# EAGLE design LooRollSensorTop (EAGLE 7.4.0)
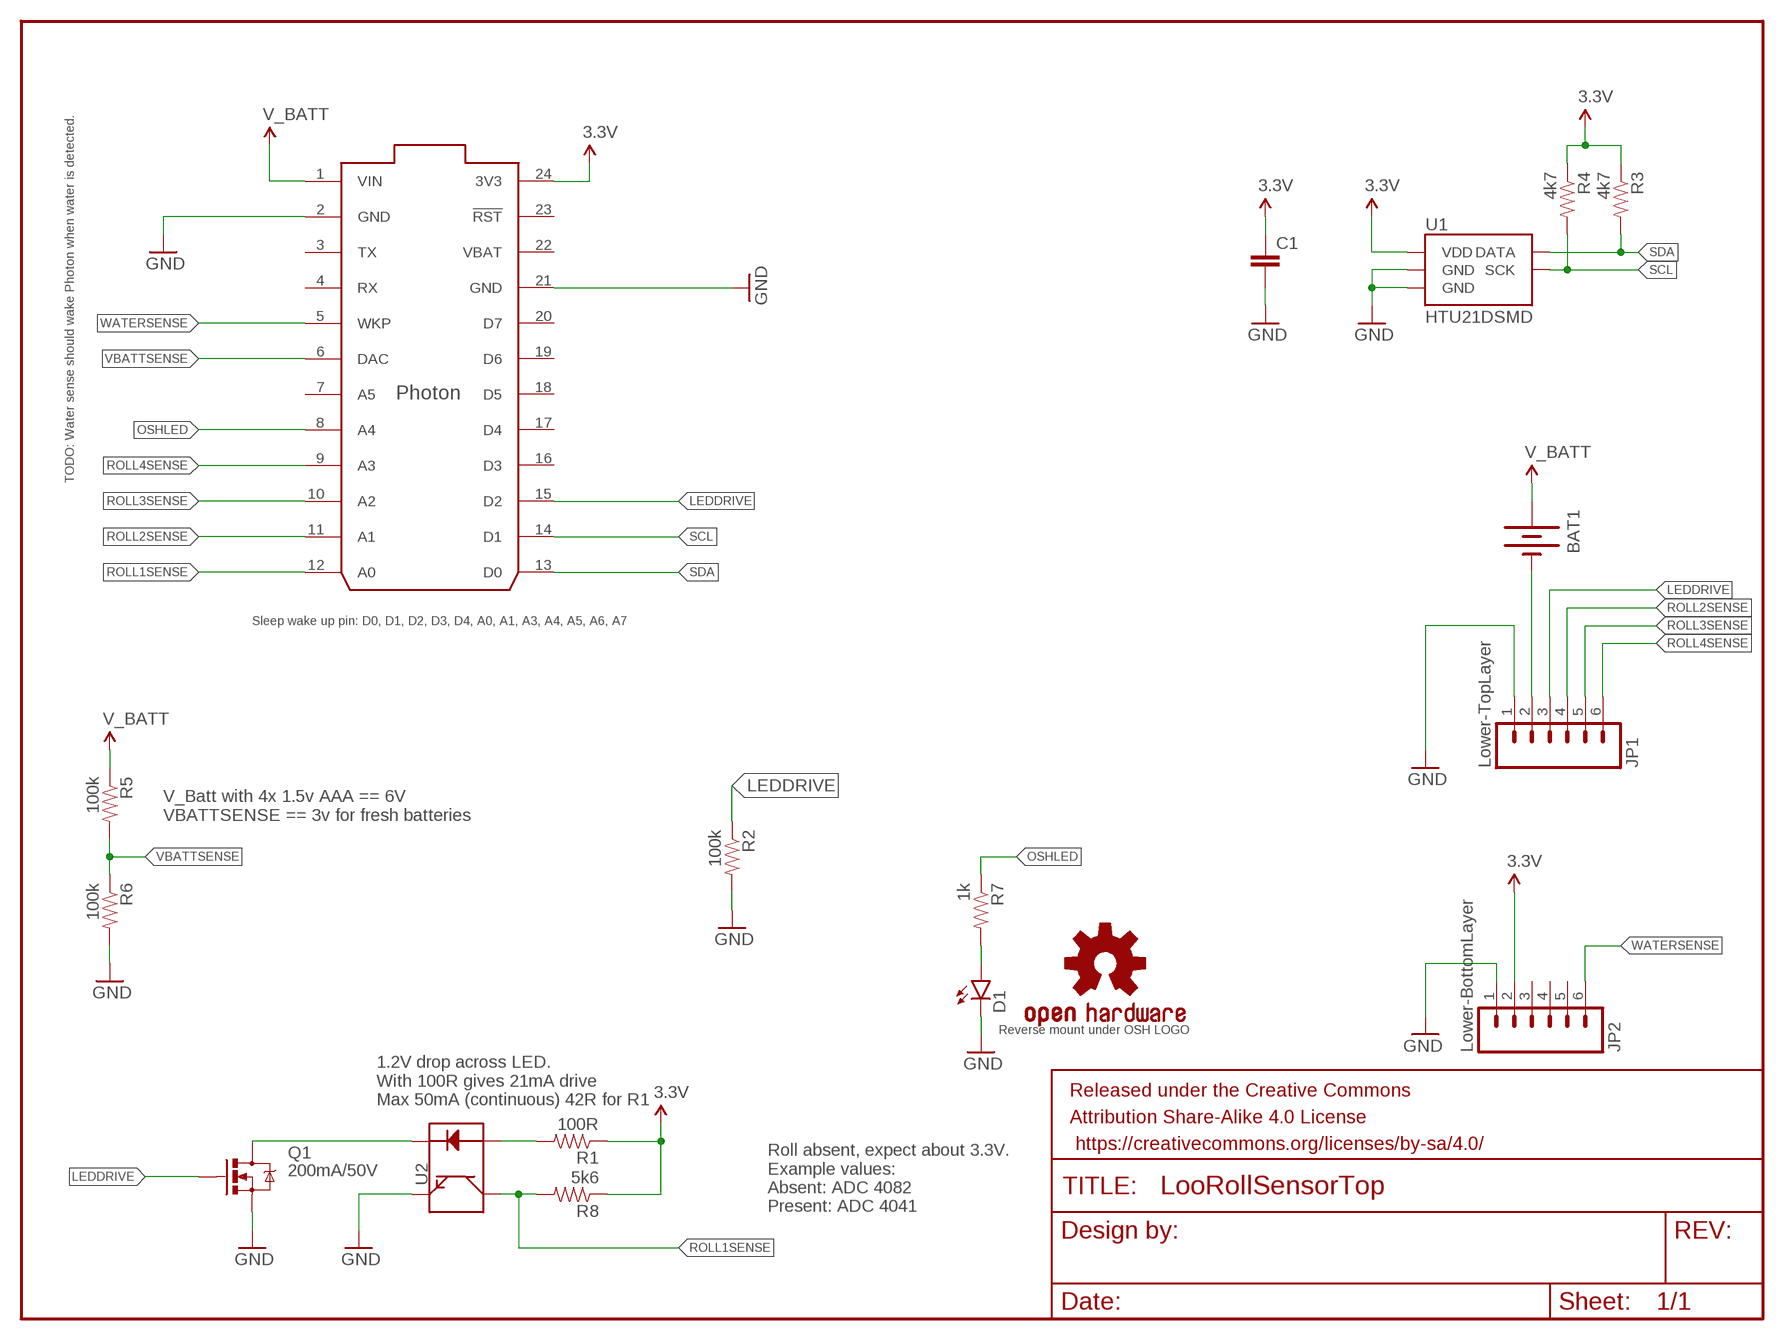
[diagram p0: schematic, sheet 1]

## Parts
BAT1  BATTERYAA-PANEL  [BATTERY-AA-PANEL]
C1  CAP0805  [0805]
D1  LED1206-BOTTOM  [LED-1206-BOTTOM]
FRAME1  FRAME-LETTER  [CREATIVE_COMMONS]
JP1  Lower-TopLayer  M061X06-SMD-EDGE-SOLDERLINK1X06-SMD-EDGE-SOLDERLINK  [1X06-SMD_EDGE]
JP2  Lower-BottomLayer  M061X06-SMD-EDGE-SOLDERLINK1X06-SMD-EDGE-SOLDERLINK  [1X06-SMD_EDGE]
LOGO1  OSHW-LOGOM  [OSHW-LOGO-M]
Q1  200mA/50V  MOSFET-NCHANNELBSS138  [SOT23-3]
R1  100R  RESISTOR1206  [1206]
R2  100k  RESISTOR1206  [1206]
R3  4k7  RESISTOR1206  [1206]
R4  4k7  RESISTOR1206  [1206]
R5  100k  RESISTOR1206  [1206]
R6  100k  RESISTOR1206  [1206]
R7  1k  RESISTOR1206  [1206]
R8  5k6  RESISTOR1206  [1206]
U1  HTU21DSMD  [HTU21D]
U2  QRE1113SMD-W  [QRE1113-W]
U$1  PHOTON_WITH_HEADERS  [PHOTON]

## Nets
3.3V: C1.1 JP2.2 R1.1 R3.1 R4.1 R8.1 U1.VDD U$1.24(3V3)
GND: C1.2 D1.C JP1.1 JP2.1 Q1.2(S) R2.2 R6.2 U1.7(GND) U1.GND U2.4(E) U$1.2(GND) U$1.21(GND)
LEDDRIVE: JP1.3 Q1.1(G) R2.1 U$1.15(D2)
N$1: Q1.3(D) U2.2(K)
N$3: R1.2 U2.1(A)
N$5: D1.A R7.2
N$11: BAT1.- JP1.2
OSHLED: R7.1 U$1.8(A4)
ROLL1SENSE: R8.2 U2.3(C) U$1.12(A0)
ROLL2SENSE: JP1.4 U$1.11(A1)
ROLL3SENSE: JP1.5 U$1.10(A2)
ROLL4SENSE: JP1.6 U$1.9(A3)
SCL: R4.2 U1.SCK U$1.14(D1)
SDA: R3.2 U1.DATA U$1.13(D0)
V_BATT: BAT1.+ R5.1 U$1.1(VIN)
VBATTSENSE: R5.2 R6.1 U$1.6(DAC)
WATERSENSE: JP2.6 U$1.5(WKP)
Unconnected: JP2.3 JP2.4 JP2.5 U$1.3(TX) U$1.4(RX) U$1.7(A5) U$1.16(D3) U$1.17(D4) U$1.18(D5) U$1.19(D6) U$1.20(D7) U$1.23(!RST)

## Notes on the sheet
- TODO: Water sense should wake Photon when water is detected.
- Sleep wake up pin: D0, D1, D2, D3, D4, A0, A1, A3, A4, A5, A6, A7
- V_Batt with 4x 1.5v AAA == 6V
  VBATTSENSE == 3v for fresh batteries
- Reverse mount under OSH LOGO
- 1.2V drop across LED.
  With 100R gives 21mA drive
  Max 50mA (continuous) 42R for R1
- Roll absent, expect about 3.3V.
  Example values:
  Absent: ADC 4082
  Present: ADC 4041

## Power pins joined to a net without a drawn wire
VBAT: U$1.22(VBAT)

## Library data of the parts
BAT1 = SparkFun-Electromechanical:BATTERY: Battery Holders Various common sizes : AA, AAA, 18650 (PRT-12895), 20mm coin cell and 12mm coin cell. 20MM_4LEGS, BATT-10373; FARNELL: 1650669
C1 = SparkFun-Capacitors:CAP: Capacitor Standard 0603 ceramic capacitor, and 0.1" leaded capacitor.
D1 = SparkFun-LED:LED: LEDs Standard schematic elements and footprints for 5mm, 3mm, 1206, and 0603 sized LEDs. 5mm - Spark Fun Electronics SKU : COM-00529 (and others)
FRAME1 = SparkFun-Aesthetics:FRAME-LETTER: Schematic Frame Standard 8.5x11 US Letter frame
JP1 JP2 = Tinamous:M06: Header 6 Standard 6-pin 0.1" header. Use with straight break away headers (SKU : PRT-00116), right angle break away headers (PRT-00553), swiss pins (PRT-00743), machine pins (PRT-00117), and female headers (PRT-00115). Molex polarized connector foot print use with SKU : PRT-08094 with associated crimp pins and housings. NOTES ON THE VARIANTS LOCK and LOCK_LONGPADS... This footprint was designed to help hold the alignment of a through-hole component (i.e. 6-pin header) while soldering it into place. You may notice that each hole has been shifted either up or down by 0.005 of an inch from it's more standard position (which is a perfectly straight line). This slight alteration caused the pins (the squares in the middle) to touch the edges of the holes. Because they are alternating, it causes a "brace" to hold the component in place. 0.005 has proven to be the perfect amount of "off-center" position when using our standard breakaway headers. Although looks a little odd when you look at the bare footprint, once you have a header in there, the alteration is very hard to notice. Also,if you push a header all the way into place, it is covered up entirely on the bottom side. This idea of altering the position of holes to aid alignment will be further integrated into the Sparkfun Library for other footprints. It can help hold any component with 3 or more connection pins.
LOGO1 = SparkFun-Aesthetics:OSHW-LOGO: Open Source Hardware Logo This logo indicates the piece of hardware it is found on incorporates a OSHW license and/or adheres to the definition of open source hardware found here: http://freedomdefined.org/OSHW
Q1 = SparkFun-DiscreteSemi:MOSFET-NCHANNEL: Common NMOSFET Parts MFG P/N Store ID Prod ID FDD8780 TRANS-09984 SI7820DN TRANS-11055 FDS6630A IC-08089 2N7002PW TRANS-11151 FQP30N06L COM-10213 TRANS-10060 BSS123LT1G TRANS-08345 BSS138 TRANS-00830 BS170 2N7000; PROD_ID: TRANS-00830
R1-R8 = SparkFun-Resistors:RESISTOR: Resistor Basic schematic elements and footprints for 0603, 1206, and PTH resistors.
U1 = SparkFun-Sensors:HTU21D; PROD_ID: IC-11793
U2 = SparkFun-Sensors:QRE1113: Reflective object sensor
U$1 = Particle:PHOTON

## Board
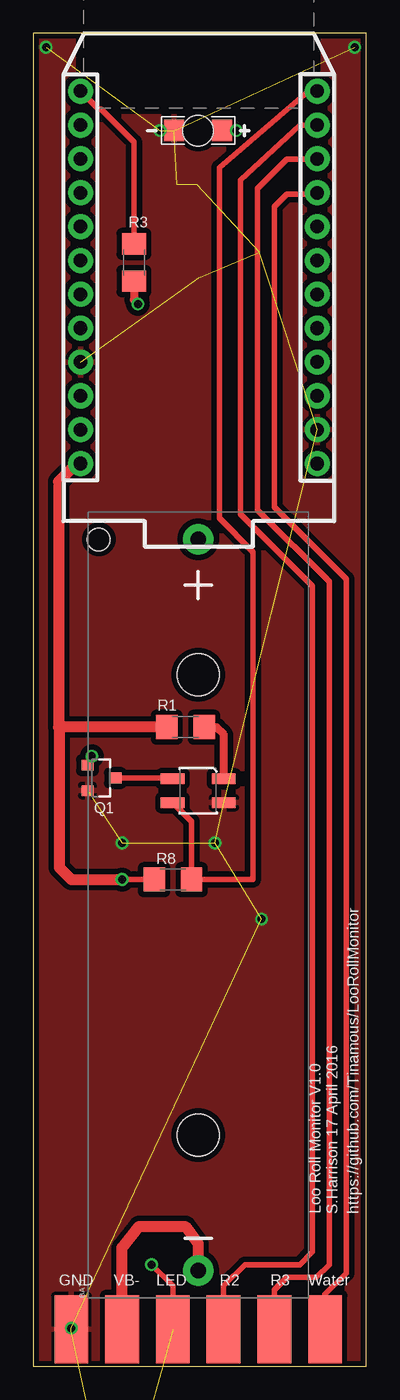
[diagram p1: board, top side]
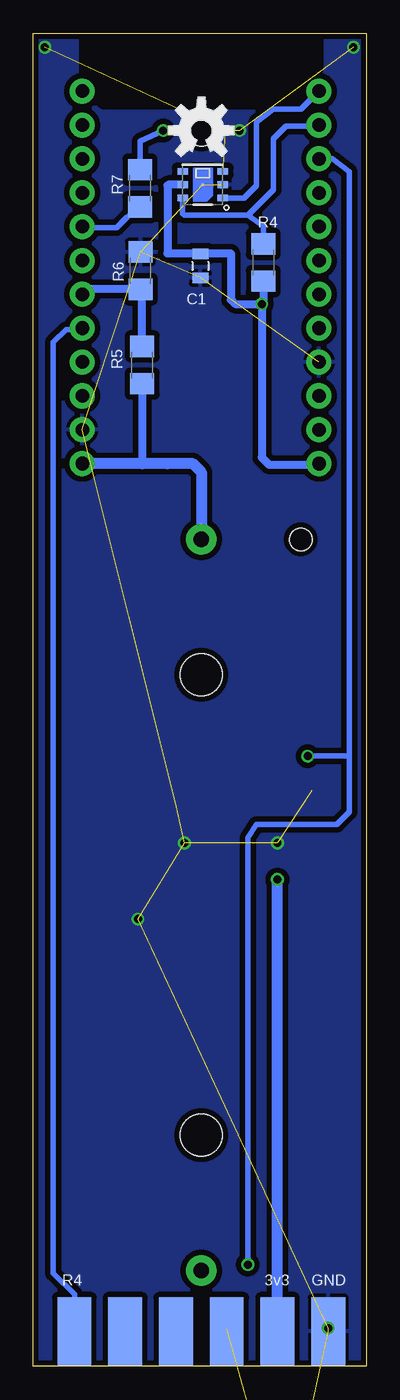
[diagram p2: board, bottom side, seen from below]

Size 25 x 100 mm. Coordinates in mm from the lower left corner, seen from the top.
Outline: 0,0 25,0 25,100 0,100 0,0
Copper layers (1*16): Top 0.0356mm / dielectric 1.5011mm / Bottom 0.0356mm
Design rules "OSHPark": minimum track width 6mil, minimum drill 13mil, track to track 6mil, track to pad 6mil, pad to pad 6mil, via to via 6mil, smd to smd 6mil, copper to edge 15mil, drill to drill 6mil, minimum pad ring 7mil, minimum via ring 7mil, stop-mask expansion 3mil, vias tented up to drill 0mil, thermal gap 10mil
tRestrict: area 3.8,94.6 to 21,100.2
bRestrict: area 3.8,94.9 to 21,100.2

### Footprints (pad centres in the part's own frame; a part is rotated, then mirrored left to right if it is on the bottom)
BATTERY-AA-PANEL = drill 1.17 pad 2.3: + 27.43,0; - -27.43,0 | hole 3.18: 17.27,0; -17.27,0 | hole 1.7: 27.43,7.47
0805 = smd 0.8 x 1.2: 1 -0.9,0; 2 0.9,0
LED-1206-BOTTOM = smd 1.5 x 1.6: A -1.8,0; C 1.8,0 | hole 2.3: 0,0
1X06-SMD_EDGE = smd 2.54 x 5.08: 1 0,-0.08; 2 3.81,-0.08; 3 7.62,-0.08; 4 11.43,-0.08; 5 15.24,-0.08; 6 19.05,-0.08
SOT23-3 = smd 0.8 x 0.9: 1 -0.95,-1; 2 0.95,-1; 3 0,1.1
1206 = smd 1.6 x 1.8: 1 -1.4,0; 2 1.4,0
HTU21D = smd 0.2 x 0.2: 7 0,0 | smd 0.8 x 0.5: DATA 1.5,-1; GND 1.5,0; NC@1 -1.5,1; NC@6 1.5,1; SCK -1.5,-1; VDD -1.5,0
QRE1113-W = smd 1.778 x 0.762: 1 -1.927,-0.9; 2 1.927,-0.9; 3 1.927,0.9; 4 -1.927,0.9
PHOTON = drill 1.016 pad 1.88: 1 1.27,32.258; 2 1.27,29.718; 3 1.27,27.178; 4 1.27,24.638; 5 1.27,22.098; 6 1.27,19.558; 7 1.27,17.018; 8 1.27,14.478; 9 1.27,11.938; 10 1.27,9.398; 11 1.27,6.858; 12 1.27,4.318; 13 19.05,4.318; 14 19.05,6.858; 15 19.05,9.398; 16 19.05,11.938; 17 19.05,14.478; 18 19.05,17.018; 19 19.05,19.558; 20 19.05,22.098; 21 19.05,24.638; 22 19.05,27.178; 23 19.05,29.718; 24 19.05,32.258

### Placement (x,y rotation side)
BAT1  12.38,34.61 90 top
C1  12.46,82.55 270 bottom
D1  12.38,92.71 180 top
FRAME1  35.56,20.64 90 top  (outside the outline)
JP1  2.86,2.86 0 top
JP2  2.86,2.54 180 bottom
LOGO1  12.38,92.71 0 bottom
Q1  5.08,44.13 270 top
R1  11.43,47.94 0 top
R2  6.35,-6.99 180 top  (outside the outline)
R3  7.56,82.81 90 top
R4  7.72,82.81 90 bottom
R5  16.83,75.11 90 bottom
R6  16.96,82.2 90 bottom
R7  16.99,88.37 90 bottom
R8  10.48,36.51 0 top
U1  12.28,88.65 0 bottom
U2  12.38,43.18 180 top
U$1  22.59,99.98 180 top

### Tracks (layer width: path | path; a pad name or v marks a point on that pad's centre or on a via)
3.3V  (via drill 0.6)
  Top 0.406: 3.48,67.66 U$1.24 | v6.67,36.51 R8.1
  Top 0.61: R3.1 7.56,79.98 v7.85,79.69
  Top 0.813: U$1.24 3.27,67.72 1.91,66.36 1.91,47.94 1.95,47.94 | 10.21,47.94 R1.1 1.95,47.94 | 1.95,47.94 1.95,37.42 2.86,36.51 v6.67,36.51
  Bottom 0.406: 13.79,88.64 U1.VDD | 14.87,88.64 14.92,88.58 | 3.63,67.63 U$1.24 | C1.1 14.68,83.43 11.11,83.5
  Bottom 0.61: 13.79,88.64 14.87,88.64 | 14.92,88.58 14.92,83.5 11.11,83.5 10.16,83.5 10.16,80.01 9.84,79.69 v7.85,79.69 | v7.85,79.69 7.85,68.17 7.3,67.63 3.63,67.63 | R4.1 7.72,79.82 v7.85,79.69
  Bottom 0.813: JP2.2 v6.67,36.51
GND  (via drill 0.6)  (18 unrouted)
  other vias: 6.67,39.26 2.86,2.86 13.65,39.26 17.14,33.55 9.53,92.71 24.13,98.95 0.95,98.95
  pour Bottom (isolate 0.406, rank 6): -0.64,101.03 26.67,101.03 26.67,-1.27 -0.64,-1.27
  pour Top (isolate 0.406, rank 6): 0,100.64 25.08,100.53 24.77,0 0,0
LEDDRIVE  (via drill 0.6)  (1 unrouted)
  Top 0.406: JP1.3 10.48,6.03 v8.89,7.62 | Q1.1 v4.4,45.77
  Bottom 0.406: U$1.15 2.56,90.58 1.27,89.61 1.27,45.72 | 1.27,45.72 1.27,41.59 2.22,40.64 8.26,40.64 8.89,39.69 v8.89,7.62 | v4.4,45.77 1.32,45.77 1.27,45.72
N$1
  Top 0.406: Q1.3 10.4,44.13 U2.2
N$3
  Top 0.61: 13.02,47.94 R1.2 13.65,47.94 13.35,47.93 13.77,47.93 14.31,47.39 U2.1
N$5  (via drill 0.6)
  Top 0.406: v15.24,92.71 D1.A
  Bottom 0.406: R7.2 16.99,91.91 v15.24,92.71
N$11
  Top 0.813: JP1.2 6.67,8.89 7.94,10.48 11.43,10.48 12.38,9.21 BAT1.-
OSHLED
  Bottom 0.406: R7.1 17.95,86.19 18.73,85.41 21.23,85.41 U$1.8
ROLL1SENSE
  Top 0.406: U$1.12 20.65,95.66 13.97,89.93 13.97,63.62 16.51,61.08 16.51,36.51 R8.2 11.88,40.86 U2.3
ROLL2SENSE
  Top 0.406: JP1.4 14.29,6.03 15.88,7.62 20,7.62 20.95,8.57 20.95,58.53 15.56,63.93 15.56,88.97 20,93.1 21.3,93.1 U$1.11
ROLL3SENSE
  Top 0.406: JP1.5 18.1,5.71 19.05,6.67 21.27,6.67 22.23,7.62 22.23,58.85 16.83,64.25 16.83,88.34 19.05,90.56 21.3,90.56 U$1.10
ROLL4SENSE
  Top 0.406: JP1.6 21.91,5.4 23.5,6.99 23.5,59.05 18.1,64.45 18.1,87 19.05,87.95 21.23,87.95 U$1.9
SCL
  Top 0.406: 3.52,93.1 U$1.14
  Bottom 0.406: U1.SCK 13.78,86.48 13.65,86.36 8.89,86.36 | 8.89,86.36 6.99,88.27 6.99,92.08 6.03,93.03 3.63,93.03 U$1.14 | R4.2 7.72,85.51 8.89,86.36
SDA
  Top 0.406: R3.2 7.56,91.82 5.08,94.3 4.9,94.3 U$1.13
  Bottom 0.406: U1.DATA 9.19,87.65 8.26,88.58 8.26,93.34 6.99,94.3 4.9,94.3 U$1.13
V_BATT
  Top 0.406: 21.3,67.7 U$1.1
  Bottom 0.61: R5.1 16.83,67.71
  Bottom 0.813: U$1.1 16.83,67.71 14.95,67.7 13.02,67.7 12.38,67.07 BAT1.+
VBATTSENSE
  Bottom 0.61: R5.2 16.83,80.66 R6.1 20.94,80.8 U$1.6
WATERSENSE
  Bottom 0.406: JP2.6 21.91,5.4 23.5,6.99 23.5,76.83 22.54,77.79 21.41,77.79 U$1.5

### Text on the board
tNames: Loo Roll Monitor V1.0 | S.Harrison 17 April 2016 | https://github.com/Tinamous/LooRollMonitor | GND | VB- | LED | R2 | R3 | Water
bNames: GND | 3v3 | R4
Measures: Loo Roll height 103mm | Max internal diameter of tube: 25mm (25.8)
Document: Top most board. | Bodge Resistor - hand fit.